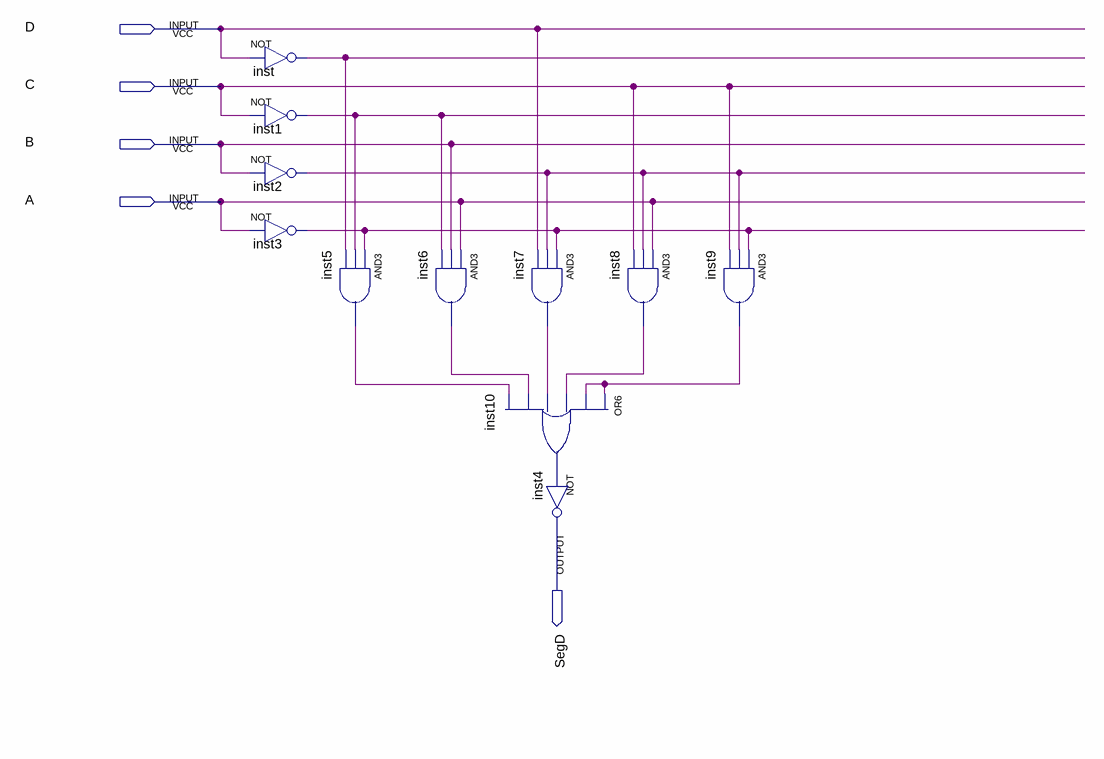
[diagram p0: schematic sheet]
// Quartus schematic SegD.bdf as structural Verilog: 11 symbols, 5 pins
module SegD (
  input  D,
  input  C,
  input  B,
  input  A,
  output SegD
);

  wire inst1_out, inst2_out, inst3_out, inst5_out, inst6_out, inst7_out, inst8_out, inst9_out, inst10_out,
       inst_out;

  not inst (inst_out, D);
  not inst1 (inst1_out, C);
  not inst2 (inst2_out, B);
  not inst3 (inst3_out, A);
  and inst5 (inst5_out, inst3_out, inst1_out, inst_out);
  and inst6 (inst6_out, A, B, inst1_out);
  and inst7 (inst7_out, inst3_out, inst2_out, D);
  or inst10 (inst10_out, inst9_out, inst9_out, inst8_out, inst7_out, inst6_out, inst5_out);
  not inst4 (SegD, inst10_out);
  and inst8 (inst8_out, A, inst2_out, C);
  and inst9 (inst9_out, inst3_out, inst2_out, C);
endmodule
